# Altium project RS_Sensor.PrjPcb
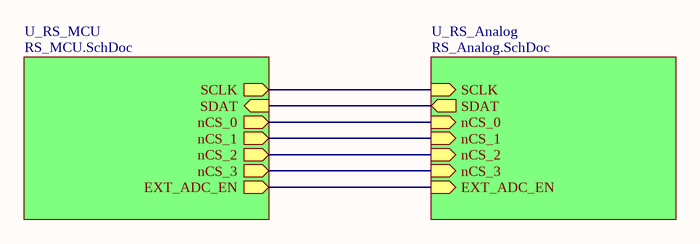
[diagram p0: _RS_TopLevel.SchDoc]
3 sheets, 135 parts. Net scope: hierarchical (ports join the sheet entries above them; power ports are global).
Board file: RS_Sensor.PcbDoc
Sheets:
  _RS_TopLevel.SchDoc
    U_RS_MCU = RS_MCU.SchDoc
    U_RS_Analog = RS_Analog.SchDoc

## Sheet _RS_TopLevel.SchDoc
size A4; SheetNumber: 1; SheetTotal: 3

### Sub-sheets
U_RS_Analog = RS_Analog.SchDoc: SDAT (out), SCLK (in), nCS_0 (in), nCS_1 (in), nCS_2 (in), nCS_3 (in), EXT_ADC_EN (in)
U_RS_MCU = RS_MCU.SchDoc: SDAT (in), SCLK (out), nCS_0 (out), nCS_1 (out), nCS_2 (out), nCS_3 (out), EXT_ADC_EN (out)

### Nets
EXT_ADC_EN: sheet U_RS_MCU/EXT_ADC_EN, sheet U_RS_Analog/EXT_ADC_EN
nCS_0: sheet U_RS_MCU/nCS_0, sheet U_RS_Analog/nCS_0
nCS_1: sheet U_RS_MCU/nCS_1, sheet U_RS_Analog/nCS_1
nCS_2: sheet U_RS_MCU/nCS_2, sheet U_RS_Analog/nCS_2
nCS_3: sheet U_RS_MCU/nCS_3, sheet U_RS_Analog/nCS_3
SCLK: sheet U_RS_MCU/SCLK, sheet U_RS_Analog/SCLK
SDAT: sheet U_RS_MCU/SDAT, sheet U_RS_Analog/SDAT

## Sheet RS_MCU.SchDoc: ЖД Весы Датчик
size 420 x 297 mm; Author: НПК "Автоматизация"; CompanyName: НПК "Автоматизация"; Organization: НПК "Автоматизация"; Revision: 1.0; SheetNumber: 2; SheetTotal: 3
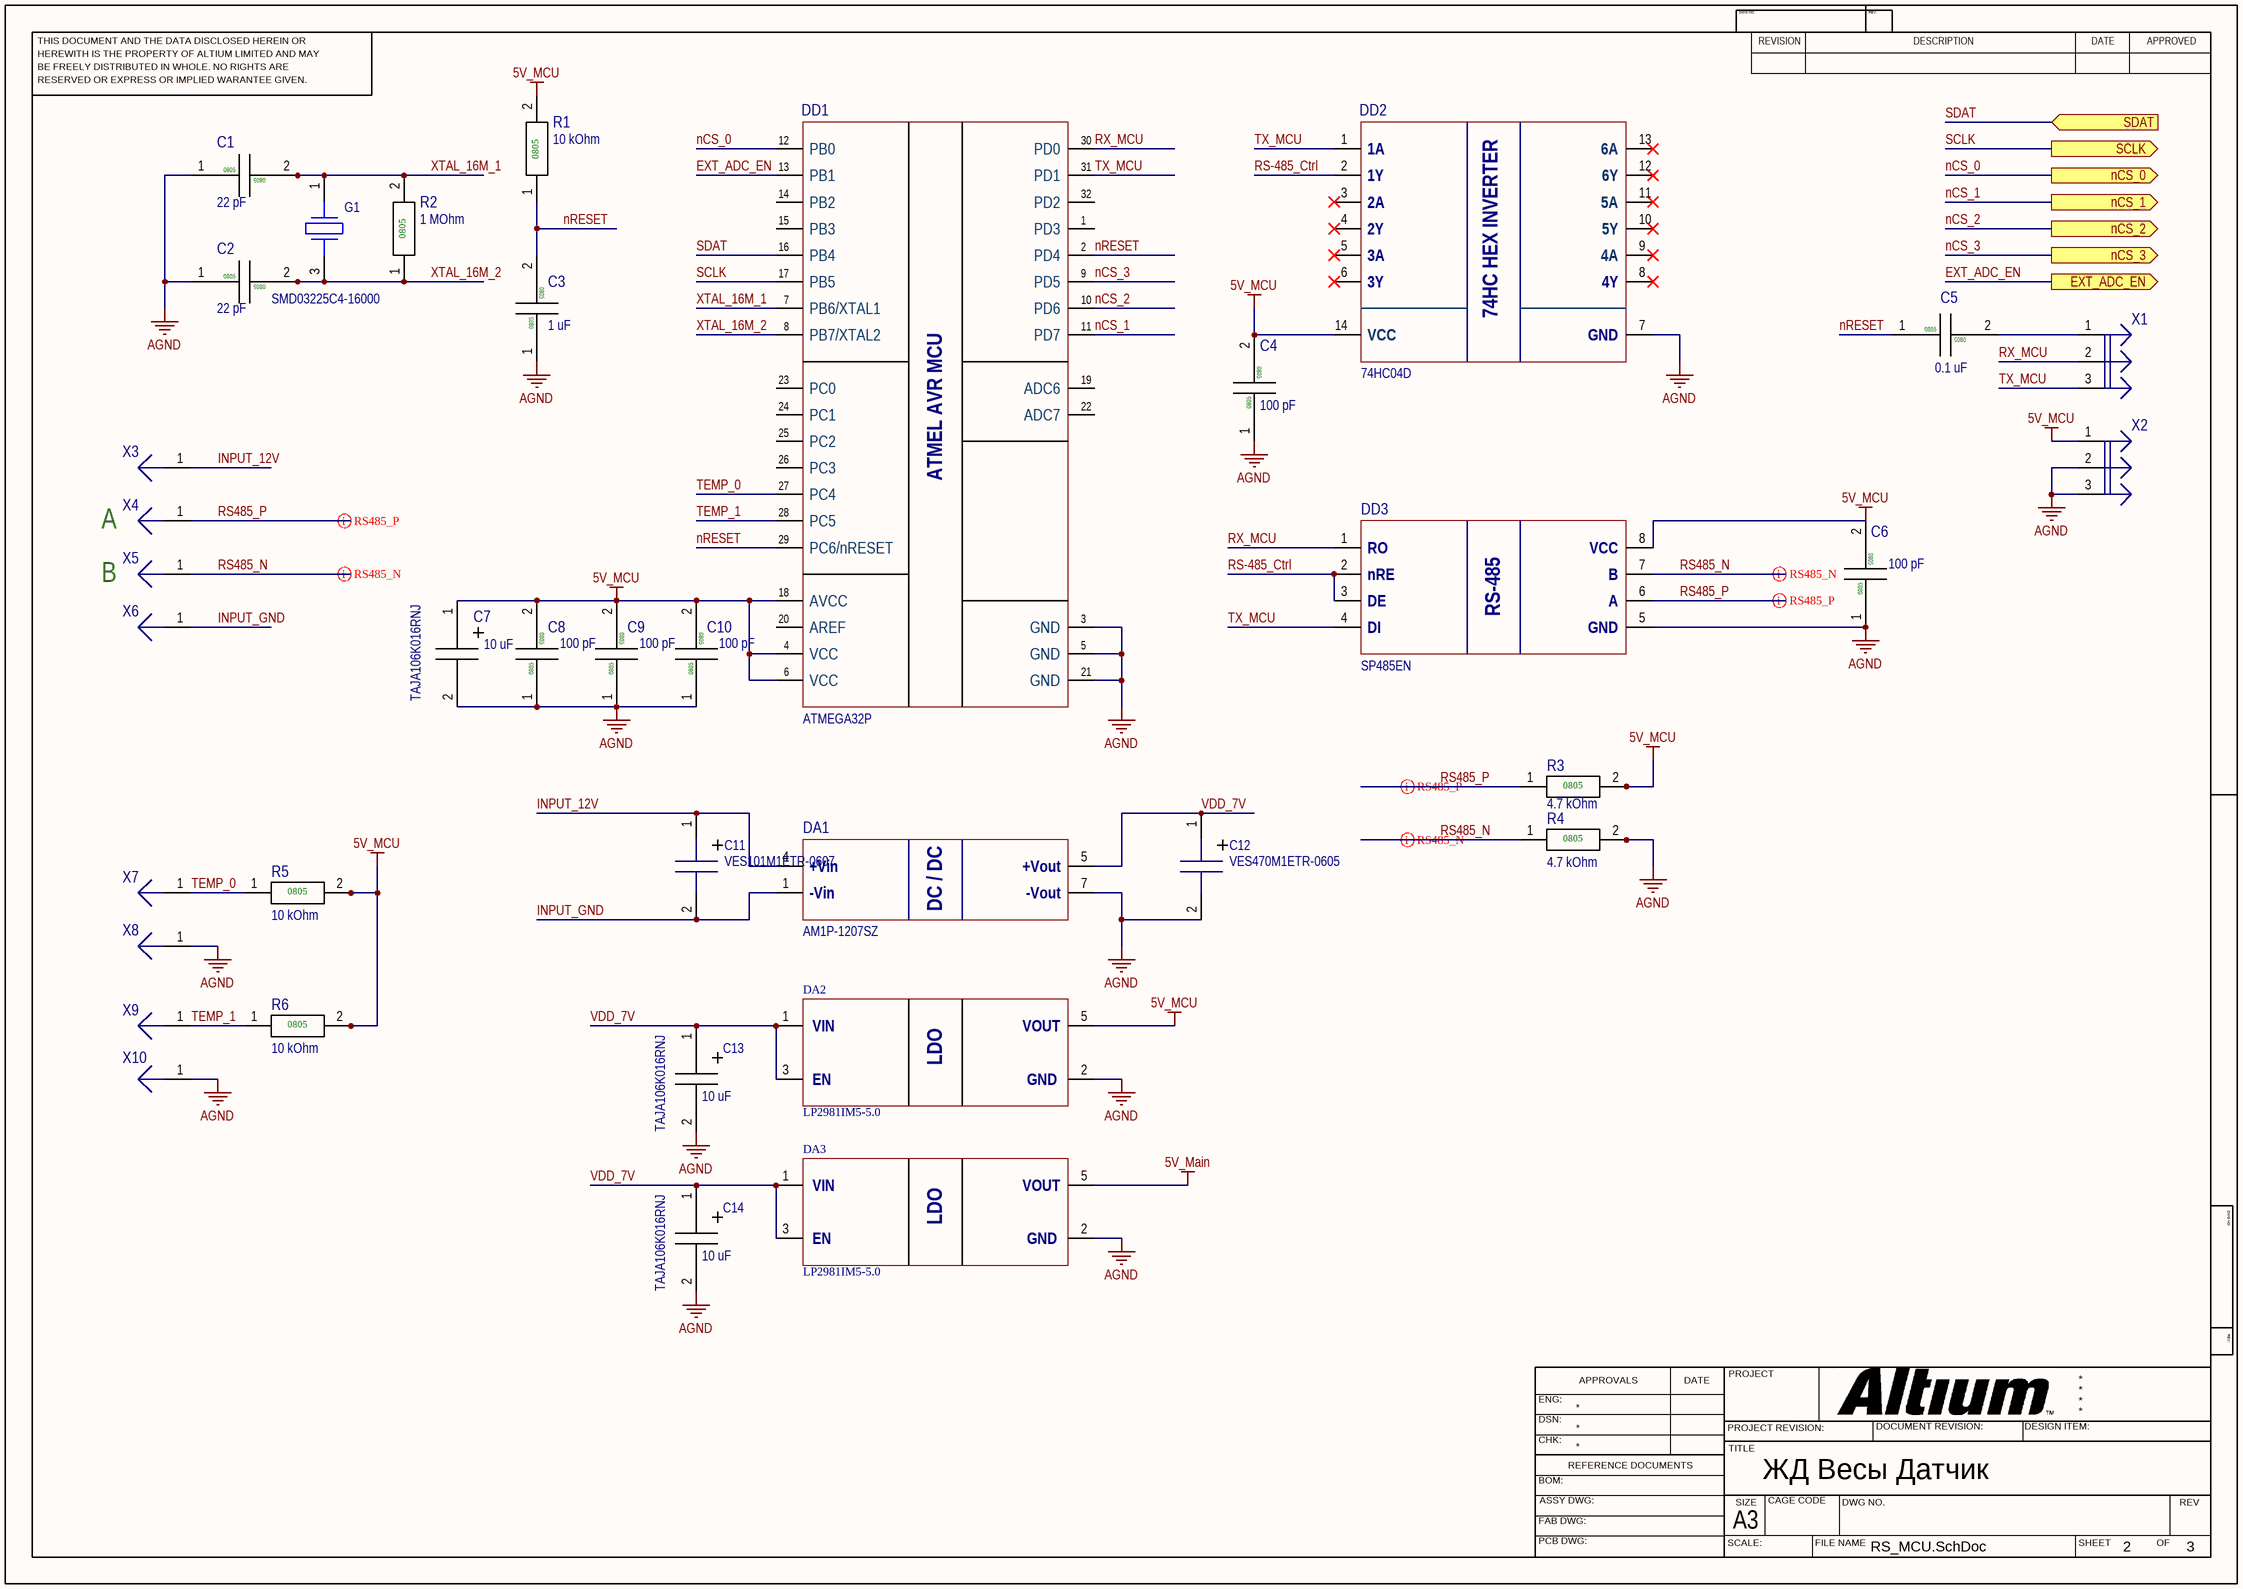
[diagram p1: RS_MCU.SchDoc]

### Parts
C1  22 pF  [CAP: 0805]
C2  22 pF  [CAP: 0805]
C3  1 uF  [CAP: 0805]
C4  100 pF  [CAP: 0805]
C5  0.1 uF  [CAP: 0805]
C6  100 pF  [CAP: 0805]
C7  TAJA106K016RNJ  CapValue: 10 uF  [CAP: TANTAL-A]
C8  100 pF  [CAP: 0805]
C9  100 pF  [CAP: 0805]
C10  100 pF  [CAP: 0805]
C11  VES101M1ETR-0607  [CAPAE-C]
C12  VES470M1ETR-0605  [CAPAE-C]
C13  TAJA106K016RNJ  CapValue: 10 uF  [CAP: TANTAL-A]
C14  TAJA106K016RNJ  CapValue: 10 uF  [CAP: TANTAL-A]
DA1  AM1P-1207SZ  [MOD_AM1P-Z]
DA2  LP2981IM5-5.0  [SOT-23-5]
DA3  LP2981IM5-5.0  [SOT-23-5]
DD1  ATMEGA32P  [32-LQFP]
DD2  74HC04D  [14-SOIC]
DD3  SP485EN  [8-SOIC]
G1  SMD03225C4-16000  [OSC: 3225]
R1  10 kOhm  [RES: 0805]
R2  1 MOhm  [RES: 0805]
R3  4.7 kOhm  [RES: 0805]
R4  4.7 kOhm  [RES: 0805]
R5  10 kOhm  [RES: 0805]
R6  10 kOhm  [RES: 0805]
X1  PLS-1X3Pin 2.54  [CON: PLS-3]  (value not drawn)
X2  PLS-1X3Pin 2.54  [CON: PLS-3]  (value not drawn)
X3  PowerSingleHole  [PowerSingle]  (value not drawn)
X4  PowerSingleHole  [PowerSingle]  (value not drawn)
X5  PowerSingleHole  [PowerSingle]  (value not drawn)
X6  PowerSingleHole  [PowerSingle]  (value not drawn)
X7  PowerSingleHole  [PowerSingle]  (value not drawn)
X8  PowerSingleHole  [PowerSingle]  (value not drawn)
X9  PowerSingleHole  [PowerSingle]  (value not drawn)
X10  PowerSingleHole  [PowerSingle]  (value not drawn)

### Ports
EXT_ADC_EN (out), nCS_0 (out), nCS_1 (out), nCS_2 (out), nCS_3 (out), SCLK (out), SDAT (in)

### Nets
5V_Main: DA3.5(VOUT)
5V_MCU: C4.2 C6.2 C7.1 C8.2 C9.2 C10.2 DA2.5(VOUT) DD1.4(VCC) DD1.6(VCC) DD1.18(AVCC) DD2.14(VCC) DD3.8(VCC) R1.2 R3.2 R5.2 R6.2 X2.1
AGND: C1.1 C2.1 C3.1 C4.1 C6.1 C7.2 C8.1 C9.1 C10.1 C12.2 C13.2 C14.2 DA1.7(-Vout) DA2.2(GND) DA3.2(GND) DD1.3(GND) DD1.5(GND) DD1.21(GND) DD2.7(GND) DD3.5(GND) R4.2 X2.2 X2.3 X8.1 X10.1
EXT_ADC_EN: DD1.13(PB1) ; port EXT_ADC_EN
INPUT_12V: C11.1 DA1.4(+Vin) X3.1
INPUT_GND: C11.2 DA1.1(-Vin) X6.1
nCS_0: DD1.12(PB0) ; port nCS_0
nCS_1: DD1.11(PD7) ; port nCS_1
nCS_2: DD1.10(PD6) ; port nCS_2
nCS_3: DD1.9(PD5) ; port nCS_3
nRESET: C3.2 C5.1 DD1.2(PD4) DD1.29(PC6/nRESET) R1.1
RS485_N: DD3.7(B) R4.1 X5.1
RS485_P: DD3.6(A) R3.1 X4.1
RS-485_Ctrl: DD2.2(1Y) DD3.2(nRE) DD3.3(DE)
RX_MCU: DD1.30(PD0) DD3.1(RO) X1.2
SCLK: DD1.17(PB5) ; port SCLK
SDAT: DD1.16(PB4) ; port SDAT
TEMP_0: DD1.27(PC4) R5.1 X7.1
TEMP_1: DD1.28(PC5) R6.1 X9.1
TX_MCU: DD1.31(PD1) DD2.1(1A) DD3.4(DI) X1.3
VDD_7V: C12.1 C13.1 C14.1 DA1.5(+Vout) DA2.1(VIN) DA2.3(EN) DA3.1(VIN) DA3.3(EN)
XTAL_16M_1: C1.2 DD1.7(PB6/XTAL1) G1.1 R2.2
XTAL_16M_2: C2.2 DD1.8(PB7/XTAL2) G1.3 R2.1
NetC5_2: C5.2 X1.1

Not connected (* = marked no-connect by the designer): DD1 1(PD3) 14(PB2) 15(PB3) 19(ADC6) 20(AREF) 22(ADC7) 23(PC0) 24(PC1) 25(PC2) 26(PC3) 32(PD2); DD2 3(2A)* 4(2Y)* 5(3A)* 6(3Y)* 8(4Y)* 9(4A)* 10(5Y)* 11(5A)* 12(6Y)* 13(6A)*

### Layout directives
differential pair: RS485_N, RS485_P

### Notes on the sheet
- A
- B
- THIS DOCUMENT AND THE DATA DISCLOSED HEREIN OR
- HEREWITH IS THE PROPERTY OF ALTIUM LIMITED AND MAY
- DWG NO:
- REVISION
- REV:
- DESCRIPTION
- DATE
- APPROVED
- BE FREELY DISTRIBUTED IN WHOLE. NO RIGHTS ARE
- RESERVED OR EXPRESS OR IMPLIED WARANTEE GIVEN.
- ENG:
- APPROVALS
- PROJECT
- DSN:
- CHK:
- REFERENCE DOCUMENTS
- PROJECT REVISION:
- TITLE
- DOCUMENT REVISION:
- DESIGN ITEM:
- BOM:
- FAB DWG:
- PCB DWG:
- ASSY DWG:
- SCALE:
- A3
- SIZE
- CAGE CODE
- FILE NAME
- DWG NO.
- SHEET
- OF
- REV
- (in symbol 0.1 uF 50V 20%) 0805
- (in symbol 1 uF 50V 20%) 0805
- (in symbol 1M 1% 1/8W) 0805
- (in symbol 4.7k 1% 1/8W) 0805
- (in symbol 10k 1% 1/8W) 0805
- (in symbol 22 pF 50V 5%) 0805
- (in symbol 74HC04D) 74HC HEX INVERTER
- (in symbol 100 pF 50V 5%) 0805
- (in symbol AM1P-1207SZ) DC / DC
- (in symbol ATMega238P) ATMEL AVR MCU
- (in symbol LP2981IM5-5.0) LDO
- (in symbol SP485EN) RS-485

### Library data of the parts
C1 C2 = 22 pF 50V 5%: 50V 22pF C0G ±5% 0805 Multilayer Ceramic Capacitors MLCC - SMD/SMT ROHS; Manufacturer: FH(Guangdong Fenghua Advanced Tech); Marker: 0805CG220J500NT; Values: 22 pF 50V 5%; Capacitance: 22 pF; Voltage: 50 V; Tolerance: 5%; Shop Link: ?; LCSC Part Number: C24658
C3 = 1 uF 50V 20%: Ceramic capacitor 0805 surface mount; Manufacturer: Samsung Electro-Mechanics; Marker: CL21B105KBFNNNE; Voltage: 50 V; Tolerance: 20%; Values: 1 uF 50V 20%; Capacitance: 1 uF; Shop Link: ?; LCSC Part Number: C28323
C4 C6 C8-C10 = 100 pF 50V 5%: Ceramic capacitor 0805 surface mount; Manufacturer: Samsung Electro-Mechanics; Marker: CL21C101JBANNNC; Voltage: 50 V; Tolerance: 5%; Values: 100 pF 50V 5%; Capacitance: 100 pF; Shop Link: ?; LCSC Part Number: C1790
C5 = 0.1 uF 50V 20%: Ceramic capacitor 0805 surface mount; Manufacturer: Yageo; Marker: CC0805KRX7R9BB104; Voltage: 50 V; Tolerance: 20%; Values: 0.1 uF 50V 20%; Capacitance: 0.1 uF; Shop Link: ?; LCSC Part Number: C49678
C7 C13 C14 = 10uF 16V 10%: 10uF 16V 3Ω@100kHz -55℃~+125℃ ±10% CASE-A_3216 Tantalum Capacitors ROHS; Manufacturer: AVX; Tolerance: 10%; Marker: TAJA106K016RNJ; Voltage: 16 V; Package: CASE A SMD 1206 (3216-18); LCSC Part Number: C7171
C11 = 47uF 25V: -45℃~+105℃ 1000hrs@105℃ 100uF 7.7mm 25V 6.3mm ±20% SMD,D6.3xL7.7mm Aluminum Electrolytic Capacitors - SMD ROHS; Manufacturer: Lelon; LCSC Part Number: C176675; Marker: VES101M1ETR-0607; Capacitance: 100 uF; Voltage: 25 V
C12 = 47uF 25V: 1000hrs@105℃ -45℃~+105℃ 47uF 5.3mm 25V 6.3mm ±20% SMD,6.3x5.3mm Aluminum Electrolytic Capacitors - SMD ROHS; Manufacturer: Lelon; LCSC Part Number: C176679; Marker: VES470M1ETR-0605; Capacitance: 47 uF; Voltage: 25 V
DA1 = AM1P-1207SZ: 1W, FIXED INPUT, ISOLATED & REGULATED  SINGLE OUTPUT DC-DC CONVERTER; Manufacturer: AIMTEC; Isolation(DC): 1 kV; LCSC Part Number: --; Marker: AM1P-1207SZ; ComponentLink1Description: Shop Link; ComponentLink1URL: https://www.chipdip.ru/product0/8954725273
DA2 DA3 = LP2981IM5-5.0: Micropower 100-mA Ultralow Dropout Regulator in SOT-23 Package; Manufacturer: Texas Instruments Incorporated; Input Voltage: 6.5 - 7.5 V; Output Voltage: 5 V; Marker: LP2981IM5-5.0; LCSC Part Number: C3749295
DD1 = ATMega238P: Manufacturer: Atmel; Marker: ATMEGA32P; Shop Link: *; Core: *; ROM: *; SRAM: *; FLASH: *
DD2 = 74HC04D: Manufacturer: Shenzhen Fuman Elec; Marker: 74HC04D; LCSC Part Number: C86613
DD3 = SP485EN: Enhanced Low Power Half-Duplex / RS-485 Transceivers; Manufacturer: UMW(Youtai Semiconductor Co., Ltd.; LCSC Part Number: C23492; Marker: SP485EN
G1 = SMD03225C4-16000: Crystals WE-XTAL 16.0MHz 50ppm 13.4 x 4.9mm; Manufacturer: SDE; Frequency: 16 MHz; Marker: SMD03225C4-16000; LCSC Part Number: *; ComponentLink1Description: Shop Link; ComponentLink1URL: https://www.chipdip.ru/product0/8010208543
R1 R5 R6 = 10k 1% 1/8W: LEAD-FREE THICK FILM CHIP RESISTORS; Manufacturer: Uniroyal Elec; Marker: 0805W8F1002T5E; Tolerance: 1%; Power: 1/8 W; Resistance: 10 kOhm; LCSC Part Number: C17414
R2 = 1M 1% 1/8W: LEAD-FREE THICK FILM CHIP RESISTORS; Manufacturer: Uniroyal Elec; Marker: 0805W8F1004T5E; Tolerance: 1%; Power: 1/8 W; Resistance: 1 MOhm; LCSC Part Number: C17514
R3 R4 = 4.7k 1% 1/8W: LEAD-FREE THICK FILM CHIP RESISTORS; Manufacturer: Uniroyal Elec; Marker: 0805W8F4701T5E; Tolerance: 1%; Power: 1/8 W; Resistance: 4.7 kOhm; LCSC Part Number: C17673
X1 X2 = PLS-1X3Pin 2.54: Marker: PLS-1X3Pin 2.54

## Sheet RS_Analog.SchDoc
size 594 x 420 mm; SheetNumber: 3; SheetTotal: 3
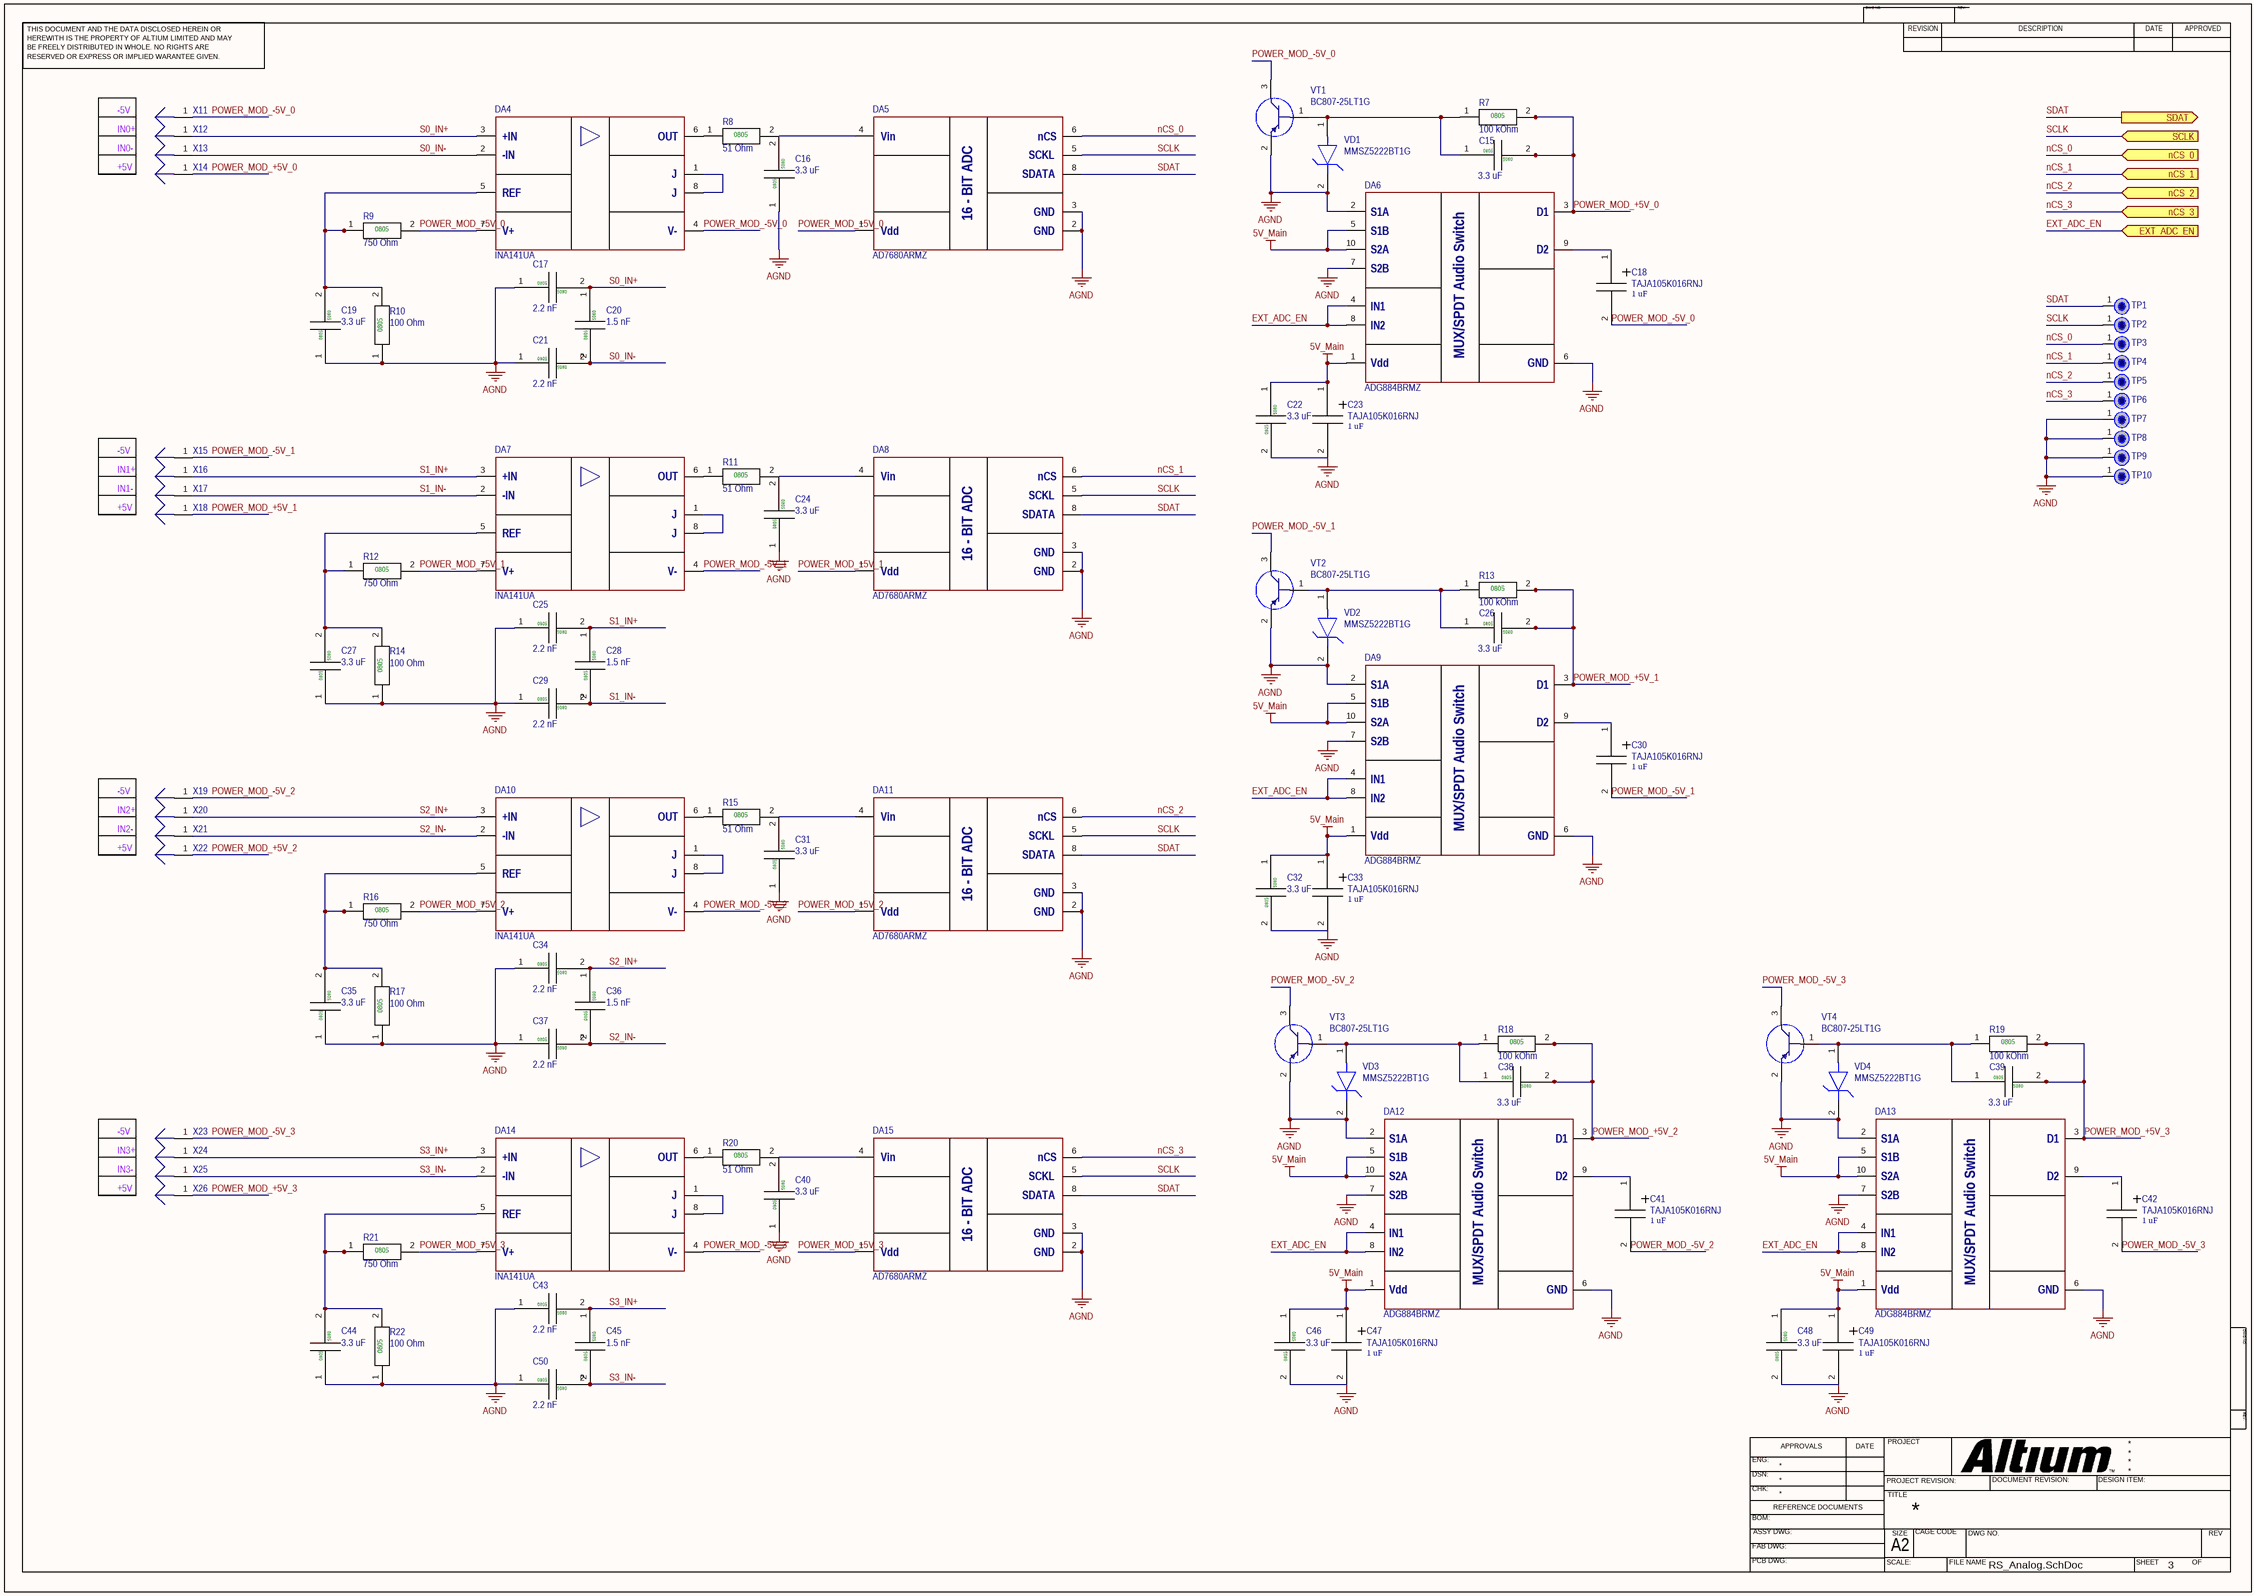
[diagram p2: RS_Analog.SchDoc]

### Parts
C15  3.3 uF  [CAP: 0805]
C16  3.3 uF  [CAP: 0805]
C17  2.2 nF  [CAP: 0805]
C18  TAJA105K016RNJ  CapValue: 1 uF  [CAP: TANTAL-A]
C19  3.3 uF  [CAP: 0805]
C20  1.5 nF  [CAP: 0805]
C21  2.2 nF  [CAP: 0805]
C22  3.3 uF  [CAP: 0805]
C23  TAJA105K016RNJ  CapValue: 1 uF  [CAP: TANTAL-A]
C24  3.3 uF  [CAP: 0805]
C25  2.2 nF  [CAP: 0805]
C26  3.3 uF  [CAP: 0805]
C27  3.3 uF  [CAP: 0805]
C28  1.5 nF  [CAP: 0805]
C29  2.2 nF  [CAP: 0805]
C30  TAJA105K016RNJ  CapValue: 1 uF  [CAP: TANTAL-A]
C31  3.3 uF  [CAP: 0805]
C32  3.3 uF  [CAP: 0805]
C33  TAJA105K016RNJ  CapValue: 1 uF  [CAP: TANTAL-A]
C34  2.2 nF  [CAP: 0805]
C35  3.3 uF  [CAP: 0805]
C36  1.5 nF  [CAP: 0805]
C37  2.2 nF  [CAP: 0805]
C38  3.3 uF  [CAP: 0805]
C39  3.3 uF  [CAP: 0805]
C40  3.3 uF  [CAP: 0805]
C41  TAJA105K016RNJ  CapValue: 1 uF  [CAP: TANTAL-A]
C42  TAJA105K016RNJ  CapValue: 1 uF  [CAP: TANTAL-A]
C43  2.2 nF  [CAP: 0805]
C44  3.3 uF  [CAP: 0805]
C45  1.5 nF  [CAP: 0805]
C46  3.3 uF  [CAP: 0805]
C47  TAJA105K016RNJ  CapValue: 1 uF  [CAP: TANTAL-A]
C48  3.3 uF  [CAP: 0805]
C49  TAJA105K016RNJ  CapValue: 1 uF  [CAP: TANTAL-A]
C50  2.2 nF  [CAP: 0805]
DA4  INA141UA  [8-SOIC]
DA5  AD7680ARMZ  [8-MSOP]
DA6  ADG884BRMZ  [10-MSOP]
DA7  INA141UA  [8-SOIC]
DA8  AD7680ARMZ  [8-MSOP]
DA9  ADG884BRMZ  [10-MSOP]
DA10  INA141UA  [8-SOIC]
DA11  AD7680ARMZ  [8-MSOP]
DA12  ADG884BRMZ  [10-MSOP]
DA13  ADG884BRMZ  [10-MSOP]
DA14  INA141UA  [8-SOIC]
DA15  AD7680ARMZ  [8-MSOP]
R7  100 kOhm  [RES_0805]
R8  51 Ohm  [RES: 0805]
R9  750 Ohm  [RES: 0805]
R10  100 Ohm  [RES: 0805]
R11  51 Ohm  [RES: 0805]
R12  750 Ohm  [RES: 0805]
R13  100 kOhm  [RES_0805]
R14  100 Ohm  [RES: 0805]
R15  51 Ohm  [RES: 0805]
R16  750 Ohm  [RES: 0805]
R17  100 Ohm  [RES: 0805]
R18  100 kOhm  [RES_0805]
R19  100 kOhm  [RES_0805]
R20  51 Ohm  [RES: 0805]
R21  750 Ohm  [RES: 0805]
R22  100 Ohm  [RES: 0805]
TP1  TestPoint  [TestPoint]  (value not drawn)
TP2  TestPoint  [TestPoint]  (value not drawn)
TP3  TestPoint  [TestPoint]  (value not drawn)
TP4  TestPoint  [TestPoint]  (value not drawn)
TP5  TestPoint  [TestPoint]  (value not drawn)
TP6  TestPoint  [TestPoint]  (value not drawn)
TP7  TestPoint  [TestPoint]  (value not drawn)
TP8  TestPoint  [TestPoint]  (value not drawn)
TP9  TestPoint  [TestPoint]  (value not drawn)
TP10  TestPoint  [TestPoint]  (value not drawn)
VD1  MMSZ5222BT1G  [DIODE: SOD123]
VD2  MMSZ5222BT1G  [DIODE: SOD123]
VD3  MMSZ5222BT1G  [DIODE: SOD123]
VD4  MMSZ5222BT1G  [DIODE: SOD123]
VT1  BC807-25LT1G  [SOT23]
VT2  BC807-25LT1G  [SOT23]
VT3  BC807-25LT1G  [SOT23]
VT4  BC807-25LT1G  [SOT23]
X11  *  [PowerSingle]  (value not drawn)
X12  *  [PowerSingle]  (value not drawn)
X13  *  [PowerSingle]  (value not drawn)
X14  *  [PowerSingle]  (value not drawn)
X15  *  [PowerSingle]  (value not drawn)
X16  *  [PowerSingle]  (value not drawn)
X17  *  [PowerSingle]  (value not drawn)
X18  *  [PowerSingle]  (value not drawn)
X19  *  [PowerSingle]  (value not drawn)
X20  *  [PowerSingle]  (value not drawn)
X21  *  [PowerSingle]  (value not drawn)
X22  *  [PowerSingle]  (value not drawn)
X23  *  [PowerSingle]  (value not drawn)
X24  *  [PowerSingle]  (value not drawn)
X25  *  [PowerSingle]  (value not drawn)
X26  *  [PowerSingle]  (value not drawn)

### Ports
EXT_ADC_EN (in), nCS_0 (in), nCS_1 (in), nCS_2 (in), nCS_3 (in), SCLK (in), SDAT (out)

### Nets
5V_Main: C22.1 C23.1 C32.1 C33.1 C46.1 C47.1 C48.1 C49.1 DA6.1(Vdd) DA6.5(S1B) DA6.10(S2A) DA9.1(Vdd) DA9.5(S1B) DA9.10(S2A) DA12.1(Vdd) DA12.5(S1B) DA12.10(S2A) DA13.1(Vdd) DA13.5(S1B) DA13.10(S2A)
AGND: C16.1 C17.1 C19.1 C21.1 C22.2 C23.2 C24.1 C25.1 C27.1 C29.1 C31.1 C32.2 C33.2 C34.1 C35.1 C37.1 C40.1 C43.1 C44.1 C46.2 C47.2 C48.2 C49.2 C50.1 DA5.2(GND) DA5.3(GND) DA6.2(S1A) DA6.6(GND) DA6.7(S2B) DA8.2(GND) DA8.3(GND) DA9.2(S1A) DA9.6(GND) DA9.7(S2B) DA11.2(GND) DA11.3(GND) DA12.2(S1A) DA12.6(GND) DA12.7(S2B) DA13.2(S1A) DA13.6(GND) DA13.7(S2B) DA15.2(GND) DA15.3(GND) R10.1 R14.1 R17.1 R22.1 TP7.1 TP8.1 TP9.1 TP10.1 VD1.2(Cathode) VD2.2(Cathode) VD3.2(Cathode) VD4.2(Cathode) VT1.2(Suorce) VT2.2(Suorce) VT3.2(Suorce) VT4.2(Suorce)
EXT_ADC_EN: DA6.4(IN1) DA6.8(IN2) DA9.4(IN1) DA9.8(IN2) DA12.4(IN1) DA12.8(IN2) DA13.4(IN1) DA13.8(IN2) ; port EXT_ADC_EN
nCS_0: DA5.6(nCS) TP3.1 ; port nCS_0
nCS_1: DA8.6(nCS) TP4.1 ; port nCS_1
nCS_2: DA11.6(nCS) TP5.1 ; port nCS_2
nCS_3: DA15.6(nCS) TP6.1 ; port nCS_3
POWER_MOD_+5V_0: C15.2 DA4.7(V+) DA5.1(Vdd) DA6.3(D1) R7.2 R9.2 X14.1
POWER_MOD_+5V_1: C26.2 DA7.7(V+) DA8.1(Vdd) DA9.3(D1) R12.2 R13.2 X18.1
POWER_MOD_+5V_2: C38.2 DA10.7(V+) DA11.1(Vdd) DA12.3(D1) R16.2 R18.2 X22.1
POWER_MOD_+5V_3: C39.2 DA13.3(D1) DA14.7(V+) DA15.1(Vdd) R19.2 R21.2 X26.1
POWER_MOD_-5V_0: C18.2 DA4.4(V-) VT1.3(Drain) X11.1
POWER_MOD_-5V_1: C30.2 DA7.4(V-) VT2.3(Drain) X15.1
POWER_MOD_-5V_2: C41.2 DA10.4(V-) VT3.3(Drain) X19.1
POWER_MOD_-5V_3: C42.2 DA14.4(V-) VT4.3(Drain) X23.1
S0_IN+: C17.2 C20.1 DA4.3(+IN) X12.1
S0_IN-: C20.2 C21.2 DA4.2(-IN) X13.1
S1_IN+: C25.2 C28.1 DA7.3(+IN) X16.1
S1_IN-: C28.2 C29.2 DA7.2(-IN) X17.1
S2_IN+: C34.2 C36.1 DA10.3(+IN) X20.1
S2_IN-: C36.2 C37.2 DA10.2(-IN) X21.1
S3_IN+: C43.2 C45.1 DA14.3(+IN) X24.1
S3_IN-: C45.2 C50.2 DA14.2(-IN) X25.1
SCLK: DA5.5(SCKL) DA8.5(SCKL) DA11.5(SCKL) DA15.5(SCKL) TP2.1 ; port SCLK
SDAT: DA5.8(SDATA) DA8.8(SDATA) DA11.8(SDATA) DA15.8(SDATA) TP1.1 ; port SDAT
NetC15_1: C15.1 R7.1 VD1.1(Anode) VT1.1(Suorce)
NetC16_2: C16.2 DA5.4(Vin) R8.2
NetC18_1: C18.1 DA6.9(D2)
NetC19_2: C19.2 DA4.5(REF) R9.1 R10.2
NetC24_2: C24.2 DA8.4(Vin) R11.2
NetC26_1: C26.1 R13.1 VD2.1(Anode) VT2.1(Suorce)
NetC27_2: C27.2 DA7.5(REF) R12.1 R14.2
NetC30_1: C30.1 DA9.9(D2)
NetC31_2: C31.2 DA11.4(Vin) R15.2
NetC35_2: C35.2 DA10.5(REF) R16.1 R17.2
NetC38_1: C38.1 R18.1 VD3.1(Anode) VT3.1(Suorce)
NetC39_1: C39.1 R19.1 VD4.1(Anode) VT4.1(Suorce)
NetC40_2: C40.2 DA15.4(Vin) R20.2
NetC41_1: C41.1 DA12.9(D2)
NetC42_1: C42.1 DA13.9(D2)
NetC44_2: C44.2 DA14.5(REF) R21.1 R22.2
NetDA4_1: DA4.1(J) DA4.8(J)
NetDA4_6: DA4.6(OUT) R8.1
NetDA7_1: DA7.1(J) DA7.8(J)
NetDA7_6: DA7.6(OUT) R11.1
NetDA10_1: DA10.1(J) DA10.8(J)
NetDA10_6: DA10.6(OUT) R15.1
NetDA14_1: DA14.1(J) DA14.8(J)
NetDA14_6: DA14.6(OUT) R20.1

### Notes on the sheet
- -5V
- IN0+
- IN0-
- +5V
- IN1+
- IN1-
- IN2+
- IN2-
- IN3+
- IN3-
- DWG NO:
- REV:
- THIS DOCUMENT AND THE DATA DISCLOSED HEREIN OR
- HEREWITH IS THE PROPERTY OF ALTIUM LIMITED AND MAY
- BE FREELY DISTRIBUTED IN WHOLE. NO RIGHTS ARE
- RESERVED OR EXPRESS OR IMPLIED WARANTEE GIVEN.
- REVISION
- DESCRIPTION
- DATE
- APPROVED
- ENG:
- APPROVALS
- PROJECT
- DSN:
- CHK:
- REFERENCE DOCUMENTS
- PROJECT REVISION:
- TITLE
- DOCUMENT REVISION:
- DESIGN ITEM:
- BOM:
- FAB DWG:
- PCB DWG:
- ASSY DWG:
- SCALE:
- A2
- SIZE
- CAGE CODE
- FILE NAME
- DWG NO.
- SHEET
- OF
- REV
- (in symbol 1.5 nF 50V 20%(Ext)) 0805
- (in symbol 2.2 nF 50V 10%) 0805
- (in symbol 3.3 uF 16V 10%) 0805
- (in symbol 51R 1% 1/8W) 0805
- (in symbol 100k 1% 1/8W) 0805
- (in symbol 100R 1% 1/8W) 0805
- (in symbol 750R 1% 1/8W) 0805
- (in symbol AD7680ARMZ) 16 - BIT ADC
- (in symbol ADG884BRMZ) MUX/SPDT Audio Switch

### Library data of the parts
C15 C16 C19 C22 C24 C26 C27 C31 C32 C35 C38-C40 C44 C46 C48 = 3.3 uF 16V 10%: 16V 3.3uF X7R ±10% 0805 Multilayer Ceramic Capacitors MLCC - SMD/SMT ROHS; Manufacturer: FH(Guangdong Fenghua Advanced Tech); Marker: 0805B335K160NT; Values: 3.3 uF 16V 10%; Capacitance: 3.3 uF; Voltage: 16 V; Tolerance: 10%; Shop Link: ?; LCSC Part Number: C38332
C17 C21 C25 C29 C34 C37 C43 C50 = 2.2 nF 50V 10%: 50V 2.2nF X7R ±10% 0805 Multilayer Ceramic Capacitors MLCC - SMD/SMT ROHS; Manufacturer: Samsung Electro-Mechanics; Marker: CL21B222KBCNNNC; Values: 2.2 nF 50V 10%; Capacitance: 2.2 nF; Voltage: 50 V; Tolerance: 10%; Shop Link: ?; LCSC Part Number: C64592
C18 C23 C30 C33 C41 C42 C47 C49 = 1uF 16V 10%: 1uF 16V -55℃~+125℃ ±10% CASE-A_3216 Tantalum Capacitors ROHS; Manufacturer: AVX; Tolerance: 10%; Marker: TAJA105K016RNJ; Voltage: 16 V; Package: CASE A SMD 1206 (3216-18); LCSC Part Number: C7174
C20 C28 C36 C45 = 1.5 nF 50V 20%(Ext): Ceramic capacitor 0805 surface mount; Manufacturer: Samsung Electro-Mechanics; Marker: CL21C152JBFNNNE; Voltage: 50 V; Tolerance: 20%; Values: 1.5 nF 50V 20%; Capacitance: 1.5 nF; Shop Link: ?; LCSC Part Number: C159768
DA4 DA7 DA10 DA14 = INA141UA: Precision, Low Power, G = 10, 100  INSTRUMENTATION AMPLIFIER; Manufacturer: Texas Instruments; LCS Part Number: C181633; Marker: INA141UA; Shop Link: *
DA5 DA8 DA11 DA15 = AD7680ARMZ: 3 mW, 100 kSPS,  16-Bit ADC; Manufacturer: Analog Devices; LCS Part Number: C578464; Marker: AD7680ARMZ; Shop Link: *
DA6 DA9 DA12 DA13 = ADG884BRMZ: MSOP-10 Analog Switches / Multiplexers ROHS; Manufacturer: Analog Devices; LCS Part Number: C140435; Marker: ADG884BRMZ; Shop Link: *
R7 R13 R18 R19 = 100k 1% 1/8W: LEAD-FREE THICK FILM CHIP RESISTORS; Manufacturer: Uniroyal Elec; Marker: 0805W8F1003T5E; Tolerance: 1%; Power: 1/8 W; Resistance: 100 kOhm; LCSC Part Number: C17407
R8 R11 R15 R20 = 51R 1% 1/8W: ±1% 1/8W Thick Film Resistors 150V ±100ppm/℃ -55℃~+155℃ 51Ω 0805 Chip Resistor - Surface Mount ROHS; Manufacturer: Uniroyal Elec; Marker: 0805W8F510JT5E; Resistance: 51 Ohm; Tolerance: 1%; Power: 1/8 W; LCSC Part Number: C17738
R9 R12 R16 R21 = 750R 1% 1/8W: ±1% 125mW Thick Film Resistors 150V ±100ppm/℃ -55℃~+155℃ 750Ω 0805 Chip Resistor - Surface Mount ROHS; Manufacturer: Uniroyal Elec; Marker: 0805W8F7500T5E; Power: 1/8 W; Resistance: 750 Ohm; Tolerance: 1%; LCSC Part Number: C17818
R10 R14 R17 R22 = 100R 1% 1/8W: LEAD-FREE THICK FILM CHIP RESISTORS; Manufacturer: Uniroyal Elec; Marker: 0805W8F1000T5E; Tolerance: 1%; Power: 1/8 W; Resistance: 100 Ohm; LCSC Part Number: C17408
VD1-VD4 = MMSZ5222BT1G: 100μA@1V ±5% 30Ω Single 2.38V~2.63V 500mW 2.5V SOD-123 Zener Diodes ROHS; Manufacturer: onsemi; Forward Continuous Current: 20 mA; LCSC Part Number: C150078; Marker: MMSZ5222BT1G; Peak Repetitive Peak Reverse Voltage: 2.5 V
VT1-VT4 = BC807-25LT1G: 45V 225mW 500mA 160@100mA,1V 100MHz 700mV@500mA,50mA PNP -55℃~+150℃@(Tj) SOT-23(SOT-23-3) Bipolar Transistors - BJT ROHS; Manufacturer: ON Semiconductor; Continuous Collector Current: - 500 mA; Vceo: -45 V; Power Dissipation: 300 mW; Marker: BC807-25LT1G; LCSC Part Number: C152312; Storage Temperature Range: -55 to + 175
X11-X26 = PowerSingleHole

## Nets that join several sheets
5V_Main: RS_MCU (DA3.5), RS_Analog (20 pins)
AGND: RS_MCU (25 pins), RS_Analog (60 pins)
EXT_ADC_EN: RS_MCU (DD1.13), RS_Analog (8 pins)
nCS_0: RS_MCU (DD1.12), RS_Analog (DA5.6 TP3.1)
nCS_1: RS_MCU (DD1.11), RS_Analog (DA8.6 TP4.1)
nCS_2: RS_MCU (DD1.10), RS_Analog (DA11.6 TP5.1)
nCS_3: RS_MCU (DD1.9), RS_Analog (DA15.6 TP6.1)
SCLK: RS_MCU (DD1.17), RS_Analog (5 pins)
SDAT: RS_MCU (DD1.16), RS_Analog (5 pins)